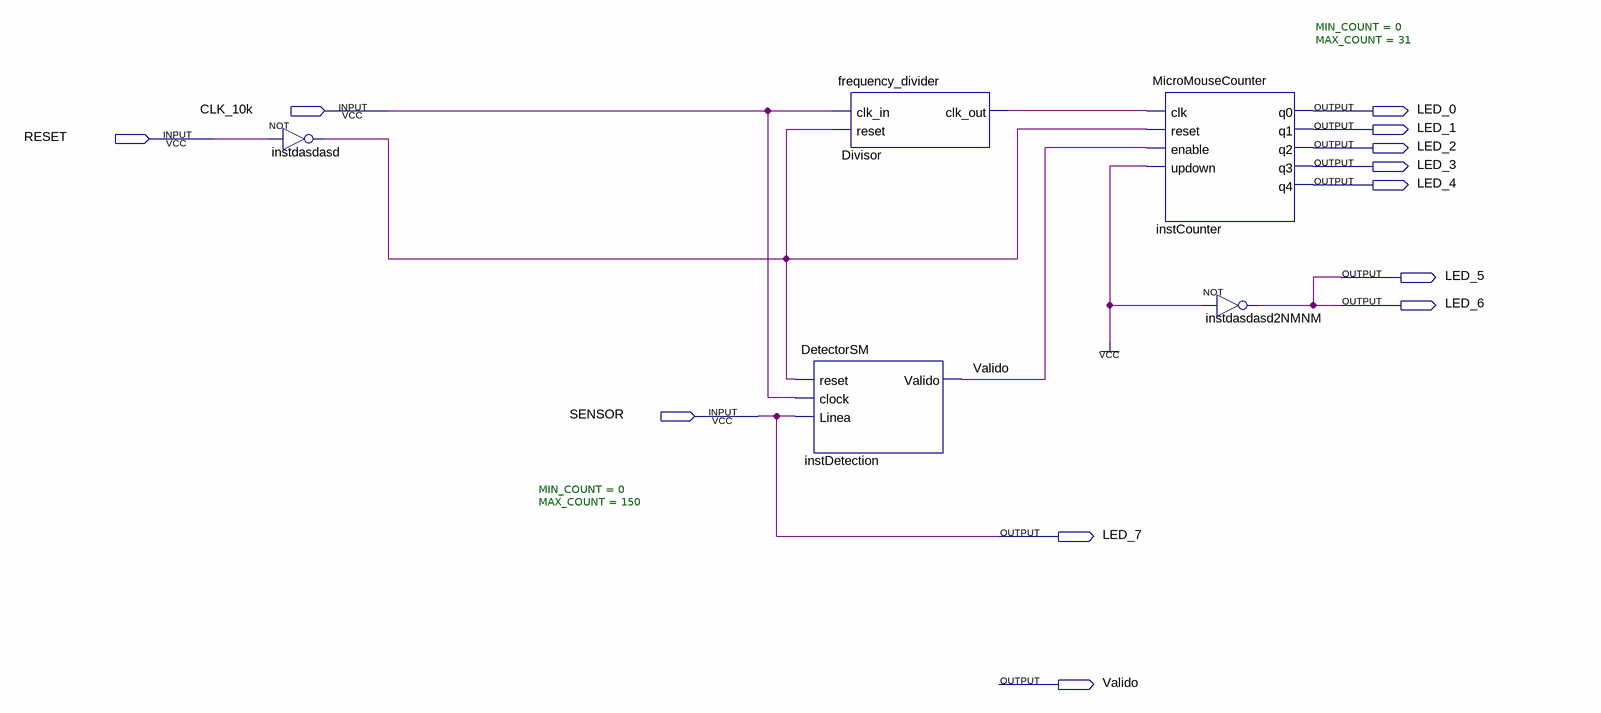
[diagram p0: schematic sheet]
// Quartus schematic MicroMouseCounterSCH.bdf as structural Verilog: 5 symbols, 12 pins
module MicroMouseCounterSCH (
  input  CLK_10k,
  input  RESET,
  input  SENSOR,
  output LED_0,
  output LED_1,
  output LED_2,
  output LED_3,
  output LED_4,
  output LED_5,
  output LED_6,
  output LED_7,
  output Valido
);

  wire Divisor_clk_out, instdasdasd_out;

  not instdasdasd (instdasdasd_out, RESET);
  frequency_divider Divisor (.clk_in(CLK_10k), .reset(instdasdasd_out), .clk_out(Divisor_clk_out));
  DetectorSM #(.MIN_COUNT(0), .MAX_COUNT(150)) instDetection (
    .reset(instdasdasd_out), .clock(CLK_10k), .Linea(SENSOR), .Valido(Valido));
  MicroMouseCounter #(.MIN_COUNT(0), .MAX_COUNT(31)) instCounter (
    .clk(Divisor_clk_out), .reset(instdasdasd_out), .enable(Valido), .updown(1'b1), .q0(LED_0), .q1(LED_1),
    .q2(LED_2), .q3(LED_3), .q4(LED_4));
  not instdasdasd2NMNM (LED_5, 1'b1);

  assign LED_6 = LED_5;
  assign LED_7 = SENSOR;
endmodule
